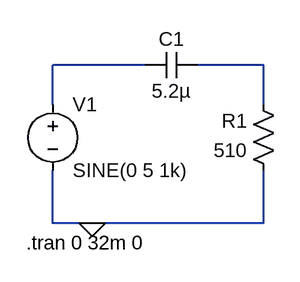
[diagram p0: schematic High_pass_filter.asc]
High_pass_filter.asc, the LTspice schematic file:
Version 4
SHEET 1 880 680
WIRE 144 80 32 80
WIRE 288 80 208 80
WIRE 32 128 32 80
WIRE 288 128 288 80
WIRE 32 272 32 208
WIRE 80 272 32 272
WIRE 288 272 288 208
WIRE 288 272 80 272
FLAG 80 272 0
SYMBOL voltage 32 112 R0
WINDOW 123 0 0 Left 0
WINDOW 39 0 0 Left 0
SYMATTR InstName V1
SYMATTR Value SINE(0 5 1k)
SYMBOL cap 208 64 R90
WINDOW 0 0 32 VBottom 2
WINDOW 3 32 32 VTop 2
SYMATTR InstName C1
SYMATTR Value 5.2µ
SYMBOL res 304 224 R180
WINDOW 0 36 76 Left 2
WINDOW 3 36 40 Left 2
SYMATTR InstName R1
SYMATTR Value 510
TEXT 0 296 Left 2 !.tran 0 32m 0

The netlist it stands for:
* High_pass_filter.asc
V1 N001 0 SINE(0 5 1k)
C1 N002 N001 5.2µ
R1 0 N002 510
.tran 0 32m 0
.backanno
.end